# Altium project quadkey.PrjPcb
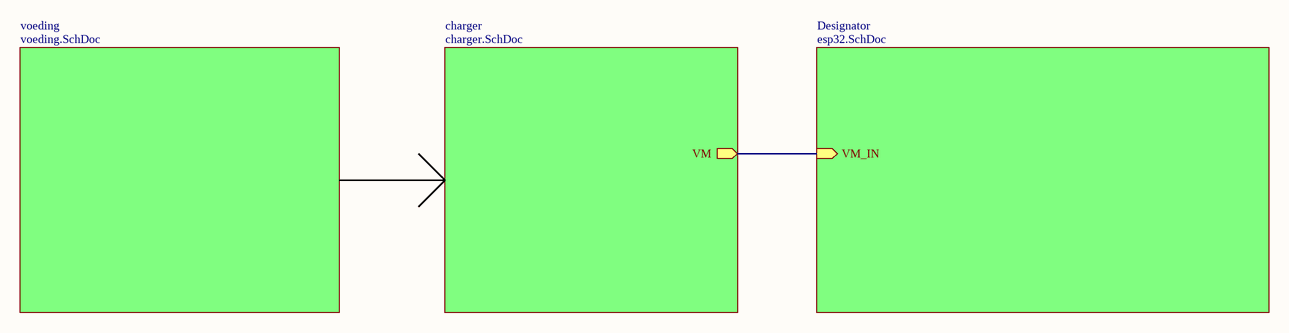
[diagram p0: top.SchDoc]
4 sheets, 35 parts. Net scope: hierarchical (ports join the sheet entries above them; power ports are global).
Board file: 6C-2L-1550um.PcbDoc
Sheets:
  top.SchDoc
    voeding = voeding.SchDoc
    Designator = esp32.SchDoc
    charger = charger.SchDoc

## Sheet top.SchDoc
size A4; SheetNumber: 1; SheetTotal: 4

### Sub-sheets
charger = charger.SchDoc: VM (out)
Designator = esp32.SchDoc: VM_IN (in)
voeding = voeding.SchDoc: no entries

### Nets
NetM1_11: sheet Designator/VM_IN, sheet charger/VM

## Sheet voeding.SchDoc
size A4; SheetNumber: 2; SheetTotal: 4
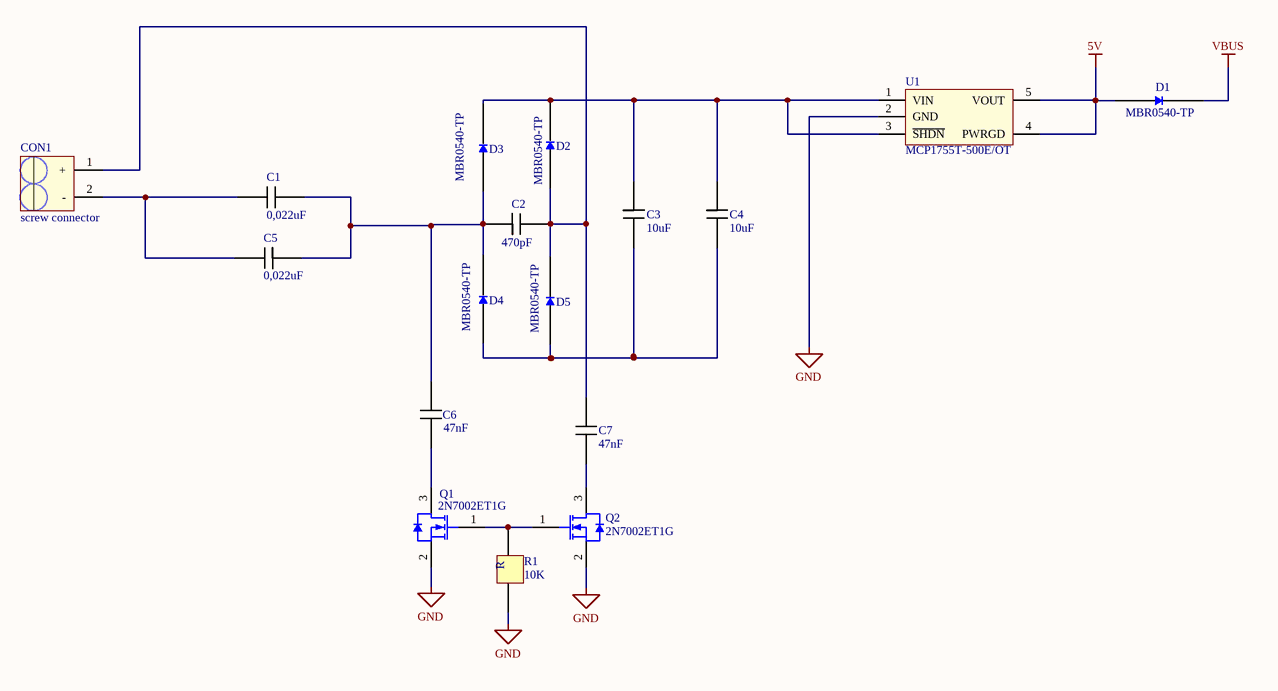
[diagram p1: voeding.SchDoc]

### Parts
C1  0,022uF  [0603]
C2  470pF  [0603]
C3  10uF  [0603]
C4  10uF  [0603]
C5  0,022uF  [0603]
C6  47nF  [0603]
C7  47nF  [0603]
CON1  screw connector  [qi coil]
D1  MBR0540-TP  [Diode]
D2  MBR0540-TP  [Diode]
D3  MBR0540-TP  [Diode]
D4  MBR0540-TP  [Diode]
D5  MBR0540-TP  [Diode]
Q1  2N7002ET1G  [N-channel FET]
Q2  2N7002ET1G  [N-channel FET]
R1  10K  [0603]
U1  MCP1755T-500E/OT  [AP2112 sot25]

### Nets
5V: D1.1 U1.4(PWRGD) U1.5(VOUT)
GND: Q1.2 Q2.2 R1.2 U1.2(GND)
VBUS: D1.2
NetC1_1: C1.1 C5.1 C6.1
NetC1_2: C1.2 C5.2 CON1.2(-)
NetC2_1: C2.1 D3.1 D4.2
NetC2_2: C2.2 C7.1 CON1.1(+) D2.1 D5.2
NetC3_1: C3.1 C4.1 D2.2 D3.2 U1.1(VIN) U1.3(~{SHDN})
NetC3_2: C3.2 C4.2 D4.1 D5.1
NetC6_2: C6.2 Q1.3
NetC7_2: C7.2 Q2.3
NetQ1_1: Q1.1 Q2.1 R1.1

### Notes on the sheet
- (in symbol resistor) R

### Library data of the parts
C1-C7 = capacitor
D1-D5 = diode
Q1 Q2 = fet
R1 = resistor

## Sheet esp32.SchDoc
size A4; SheetNumber: 3; SheetTotal: 4
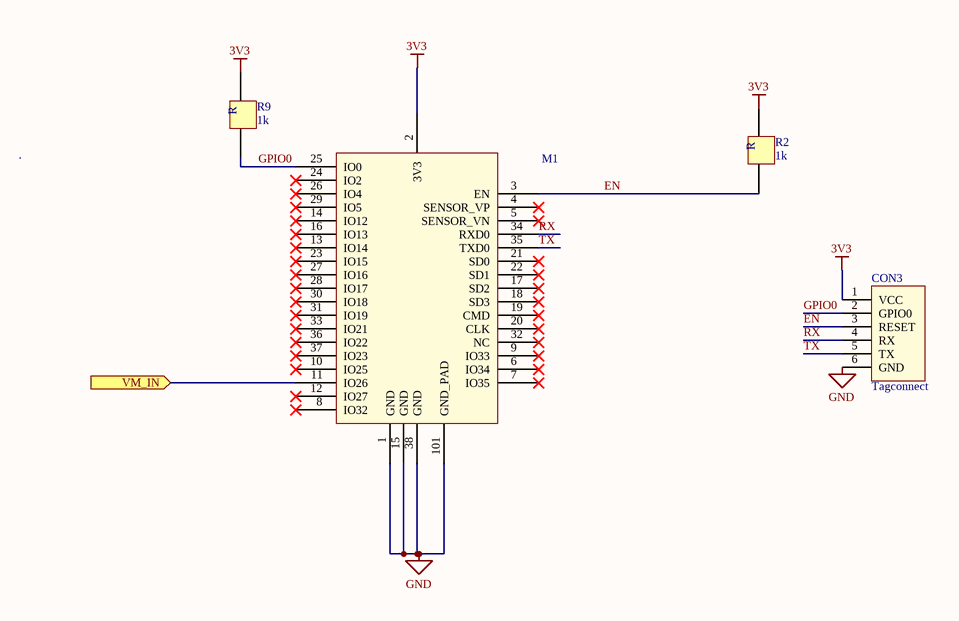
[diagram p2: esp32.SchDoc]

### Parts
CON3  Tagconnect  [Tagconnect]
M1  ESP32S_Module  [ESP32S_W]  (value not drawn)
R2  1k  [0603]
R9  1k  [0603]

### Ports
VM_IN (in)

### Nets
3V3: CON3.1(VCC) M1.2(3V3) R2.1 R9.1
GND: CON3.6(GND) M1.1(GND) M1.15(GND) M1.38(GND) M1.101(GND_PAD)
EN: CON3.3(RESET) M1.3(EN) R2.2
GPIO0: CON3.2(GPIO0) M1.25(IO0) R9.2
RX: CON3.4(RX) M1.34(RXD0)
TX: CON3.5(TX) M1.35(TXD0)
NetM1_11: M1.11(IO26) ; port VM_IN

Not connected (* = marked no-connect by the designer): M1 4(SENSOR_VP)* 5(SENSOR_VN)* 6(IO34)* 7(IO35)* 8(IO32)* 9(IO33)* 10(IO25)* 12(IO27)* 13(IO14)* 14(IO12)* 16(IO13)* 17(SD2)* 18(SD3)* 19(CMD)* 20(CLK)* 21(SD0)* 22(SD1)* 23(IO15)* 24(IO2)* 26(IO4)* 27(IO16)* 28(IO17)* 29(IO5)* 30(IO18)* 31(IO19)* 32(NC)* 33(IO21)* 36(IO22)* 37(IO23)*

### Notes on the sheet
- (in symbol resistor) R

### Library data of the parts
M1 = ESP32S_Module: Esp-32S; Datasheet: https://espressif.com/sites/default/files/documentation/esp_wroom_32_datasheet_en.pdf
R2 R9 = resistor

## Sheet charger.SchDoc
size A4; SheetNumber: 4; SheetTotal: 4
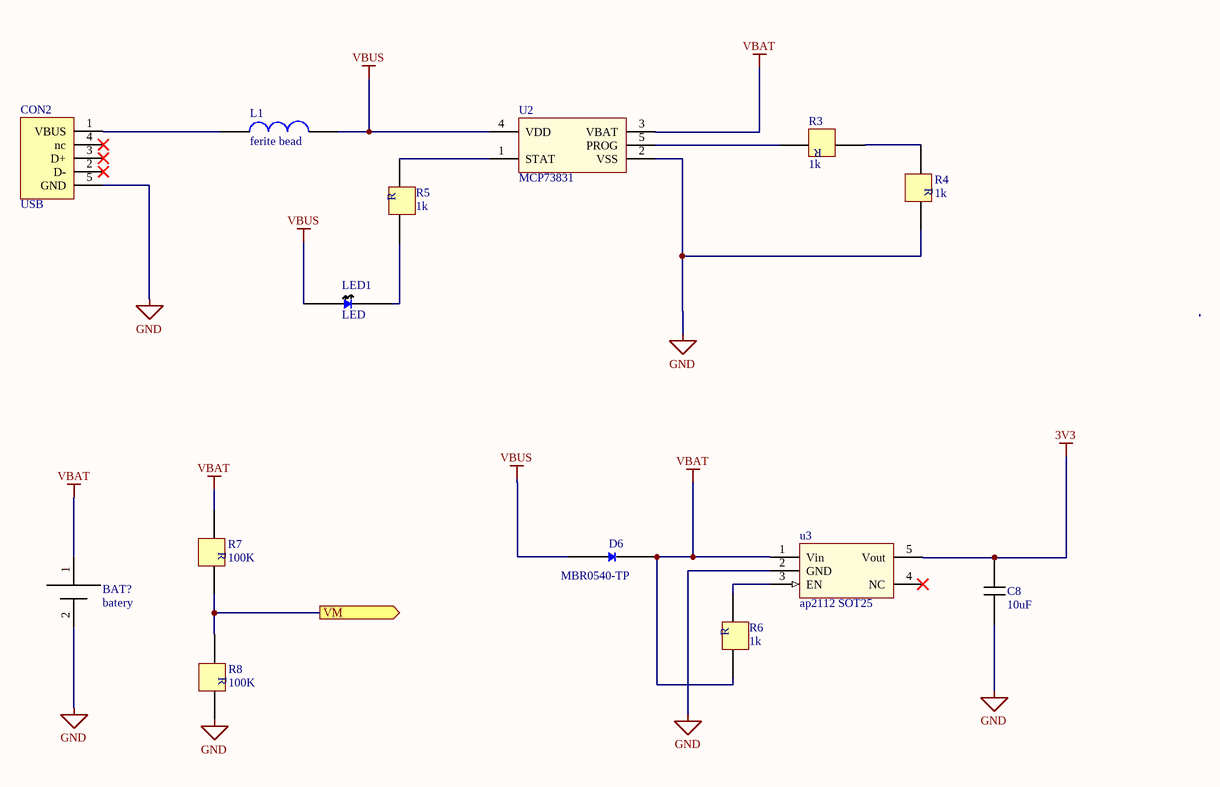
[diagram p3: charger.SchDoc]

### Parts
BAT?  batery  [jst 2pin]
C8  10uF  [0603]
CON2  USB  [microusb]
D6  MBR0540-TP  [Diode]
L1  ferite bead  [0603]
LED1  LED  [LED]
R3  1k  [0603]
R4  1k  [0603]
R5  1k  [0603]
R6  1k  [0603]
R7  100K  [0603]
R8  100K  [0603]
U2  MCP73831  [MCP73831/2]
u3  ap2112 SOT25  [AP2112 sot25]

### Ports
VM (out)

### Nets
3V3: C8.1 u3.5(Vout)
GND: BAT?.2 C8.2 CON2.5(GND) R4.1 R8.1 U2.2(VSS) u3.2(GND)
VBAT: BAT?.1 D6.2 R6.2 R7.2 U2.3(VBAT) u3.1(Vin)
VBUS: D6.1 L1.1 LED1.1 U2.4(VDD)
NetCON2_1: CON2.1(VBUS) L1.2
NetLED1_2: LED1.2 R5.2
NetM1_11: R7.1 R8.2 ; port VM
NetR3_1: R3.1 U2.5(PROG)
NetR3_2: R3.2 R4.2
NetR5_1: R5.1 U2.1(STAT)
NetR6_1: R6.1 u3.3(EN)

Not connected (* = marked no-connect by the designer): CON2 2(D-)* 3(D+)* 4(nc)*; u3 4(NC)*

### Notes on the sheet
- (in symbol resistor) R

### Library data of the parts
C8 = capacitor
D6 = diode
L1 = Spoel
R3-R8 = resistor

## Nets that join several sheets
3V3: esp32 (CON3.1 M1.2 R2.1 R9.1), charger (C8.1 u3.5)
GND: voeding (Q1.2 Q2.2 R1.2 U1.2), esp32 (5 pins), charger (7 pins)
VBUS: voeding (D1.2), charger (D6.1 L1.1 LED1.1 U2.4)
NetM1_11: esp32 (M1.11), charger (R7.1 R8.2)